# Altium schematic sheet Power_Supply_Unit.SchDoc
size A4; SheetNumber: 2; SheetTotal: 2
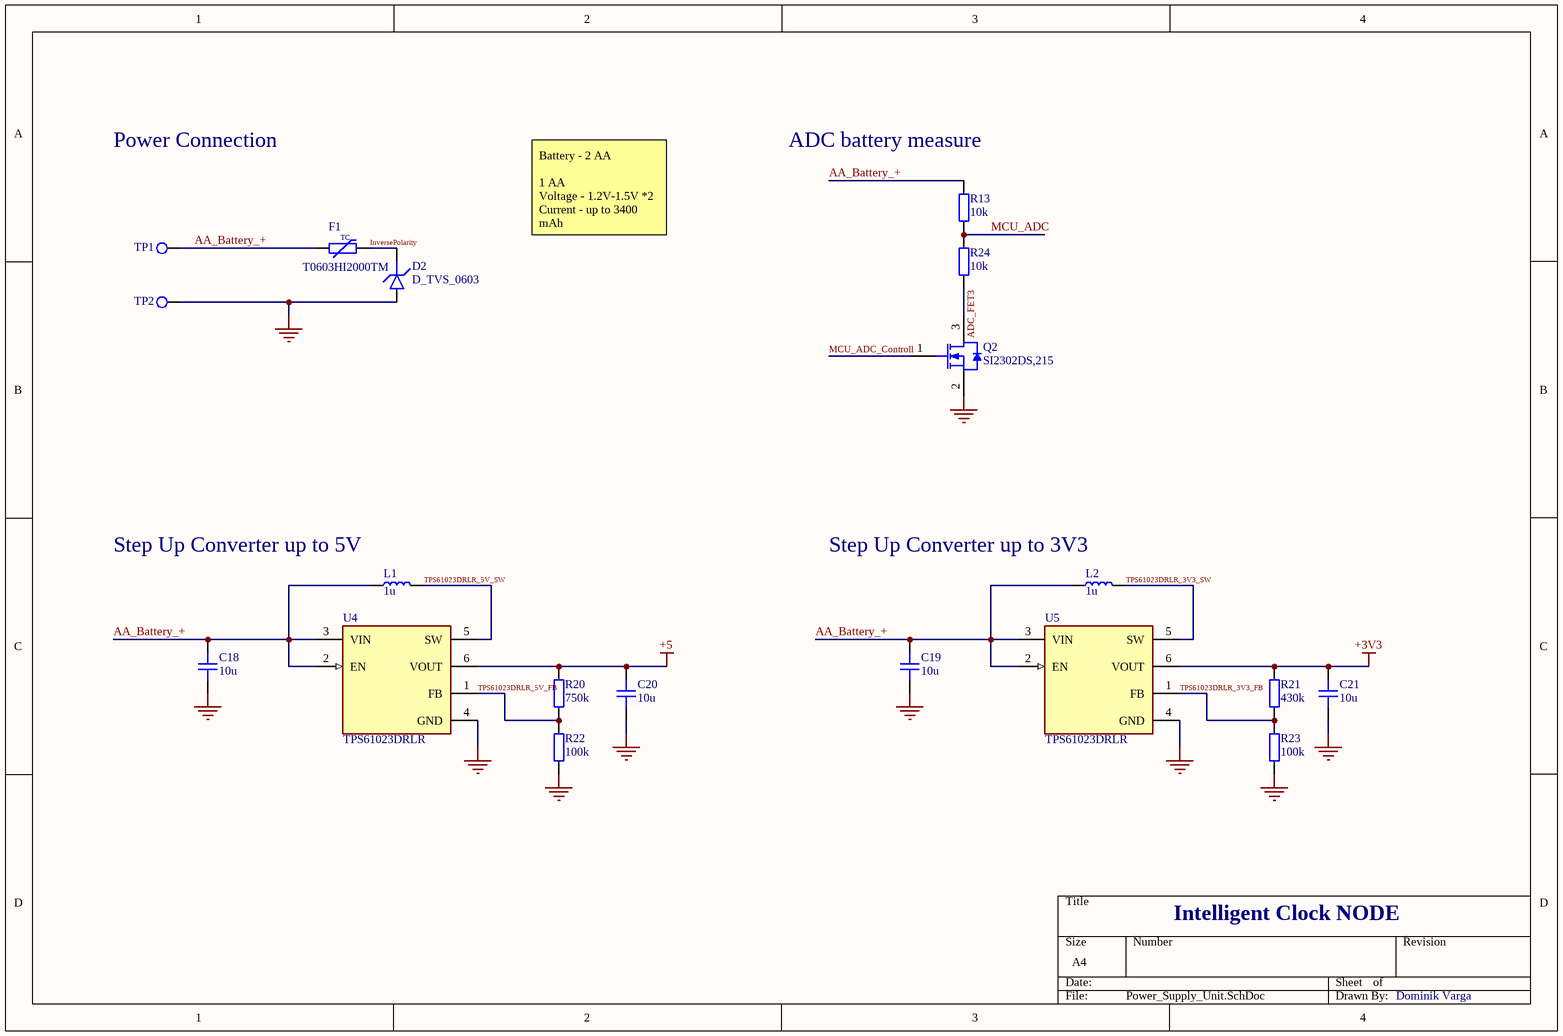
[diagram p0: Power_Supply_Unit.SchDoc]

## Parts
C18  10u  [CAP_0603]
C19  10u  [CAP_0603]
C20  10u  [CAP_0603]
C21  10u  [CAP_0603]
D2  D_TVS_0603  [DIOM2718X14N]
F1  T0603HI2000TM  [RESC1608X06N]
L1  1u  [IND_1210]
L2  1u  [IND_1210]
Q2  SI2302DS,215  [NXP-SOT23_N]
R13  10k  [RES_0603]
R20  750k  [RES_0603]
R21  430k  [RES_0603]
R22  100k  [RES_0603]
R23  100k  [RES_0603]
R24  10k  [RES_0603]
TP1  TestPoint  [SolderingPad]  (value not drawn)
TP2  TestPoint  [SolderingPad]  (value not drawn)
U4  TPS61023DRLR  [FP-DRL0006A-MFG]
U5  TPS61023DRLR  [FP-DRL0006A-MFG]

## Nets
+3V3: C21.2 R21.2 U5.6(VOUT)
+5: C20.2 R20.2 U4.6(VOUT)
GND: C18.1 C19.1 C20.1 C21.1 D2.2(A) Q2.2(S) R22.1 R23.1 TP2.1(PROG) U4.4(GND) U5.4(GND)
AA_Battery_+: C18.2 C19.2 F1.1 L1.1 L2.1 R13.2 TP1.1(PROG) U4.2(EN) U4.3(VIN) U5.2(EN) U5.3(VIN)
ADC_FET3: Q2.3(D) R24.1
InversePolarity: D2.1(K) F1.2
MCU_ADC: R13.1 R24.2
MCU_ADC_Controll: Q2.1(G)
TPS61023DRLR_3V3_FB: R21.1 R23.2 U5.1(FB)
TPS61023DRLR_3V3_SW: L2.2 U5.5(SW)
TPS61023DRLR_5V_FB: R20.1 R22.2 U4.1(FB)
TPS61023DRLR_5V_SW: L1.2 U4.5(SW)

## Notes on the sheet
- Power Connection
- (near R13) ADC battery measure
- Battery - 2 AA
  1 AA
  Voltage - 1.2V-1.5V *2
  Current - up to 3400 mAh
  usually 1.700mAh
- Fuse basic resistor?0603??
- (near L1) Step Up Converter up to 5V
- (near L2) Step Up Converter up to 3V3
- Intelligent Clock NODE
- Dominik Varga
- (in symbol FUSE_0603) TC

## Library data of the parts
C18-C21 = CAP_0603_10V: Capacitor SMD 0603 10V
D2 = D_TVS_0603: Diode TVS / ESD 0603
F1 = FUSE_0603: Fuse SMD 0603; Manufacturer: AEM; Manufacturer Part Number: T0603HI2000TM; DataSheet: https://datasheet.lcsc.com/lcsc/1811151158_AEM-T0603HI2000TM_C311070.pdf
L1 L2 = IND_1210: Inductor SMD 1210
Q2 = CMP-1258-00133-1: N-Channel Enhancement Mode Field-Effect Transistor, 20 V, 2.5 A, 3-Pin SOT23, Tape and Reel; Manufacturer: NXP Semiconductors; Ciss [typ] (pF): 230; VDS [max] (V): 20; Channel Type: N; Coss [typ] (pF): 125; ID [max] (A): 2.5; Packing: Tape & Reel; DatasheetVersion: Rev. 02; PackageVersion: 06-03-16, 03/2006; Code_JEDEC: TO-236AB; ComponentLink3Description: Package Specification; PartNumber: SI2302DS,215; ComponentLink2URL: http://www.nxp.com/documents/data_sheet/SI2302DS.pdf; PackageDescription: 3-Pin Small Outline Transistor Package, Body 2.9 x 1.3 mm, Pitch 0.95 mm; ComponentLink2Description: Datasheet; ComponentLink1Description: Manufacturer URL; Mounting Technology: Surface Mount; ComponentLink1URL: http://www.nxp.com/; ComponentLink3URL: http://www.nxp.com/documents/outline_drawing/sot023_po.pdf; PackageReference: SOT23
R13 R20-R24 = RES_0603: Resistor SMD 0603
U4 U5 = CMP-04918-000638-1: FINISH GOODS FOR TPS61023